# Altium schematic sheet Page08 CPU MISC.SchDoc
size 297 x 209 mm
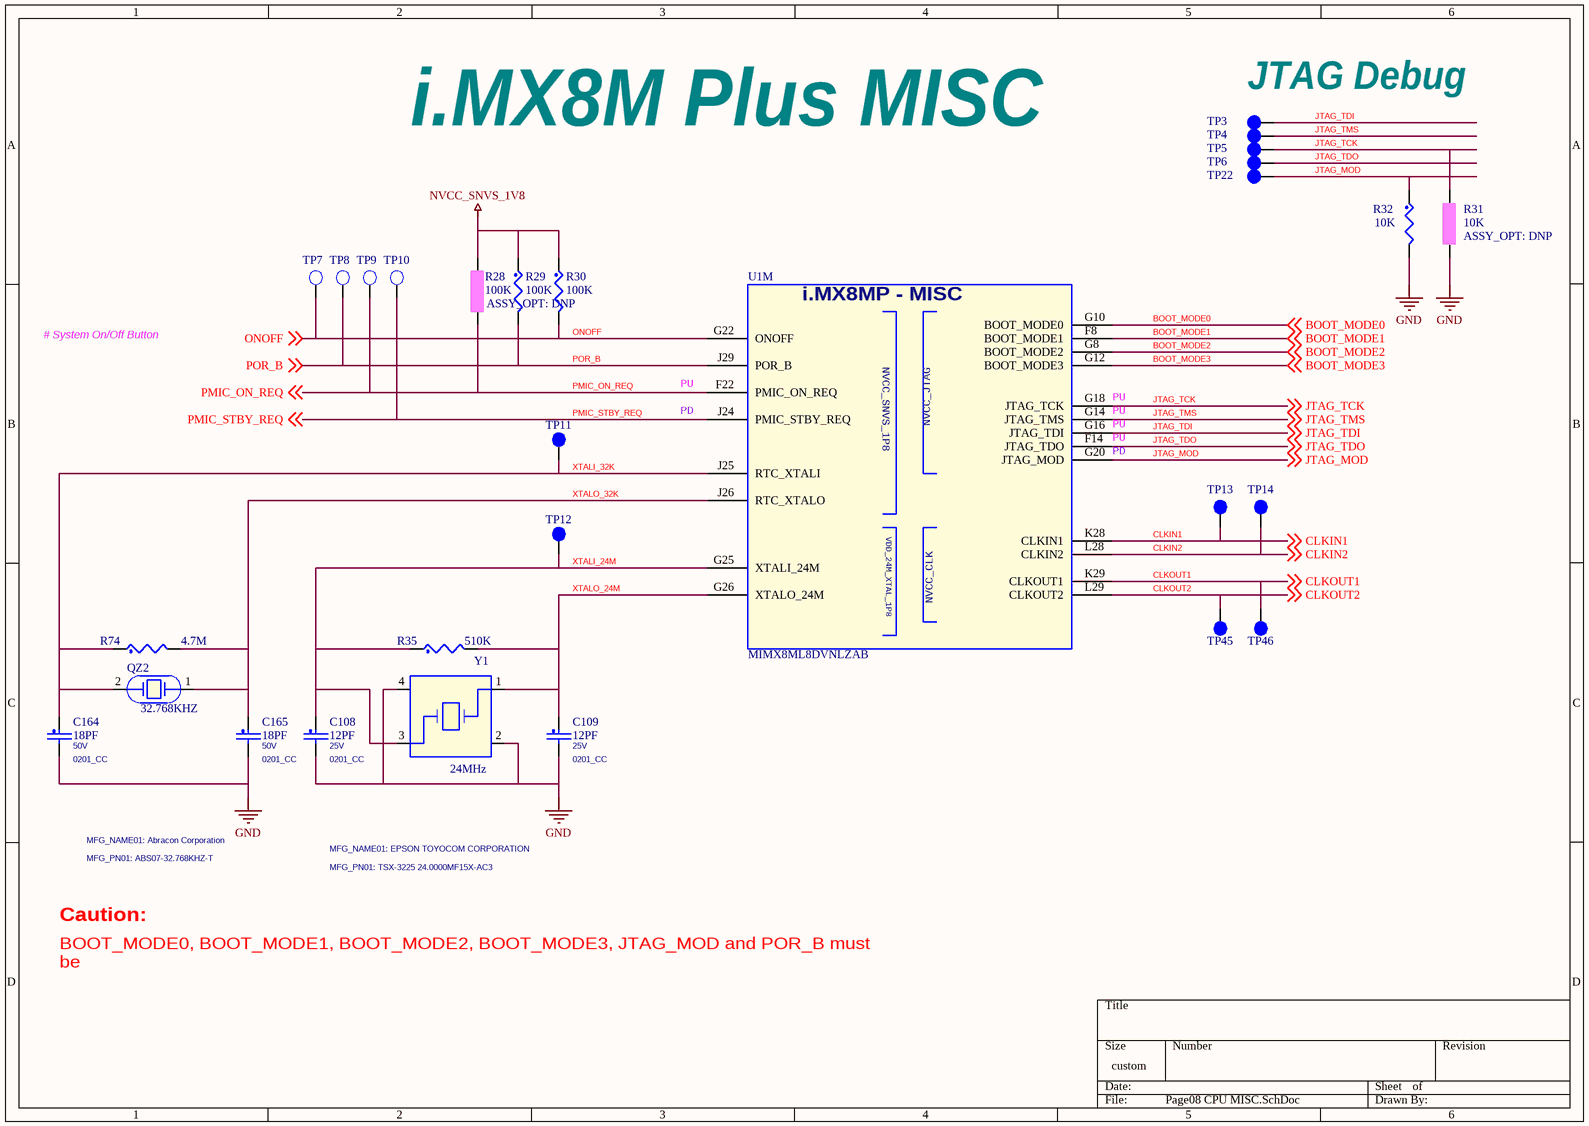
[diagram p0: Page08 CPU MISC.SchDoc]

## Parts
C108  12PF  VOLTAGE: 25V  [0201_CC]
C109  12PF  VOLTAGE: 25V  [0201_CC]
C164  18PF  VOLTAGE: 50V  [0201_CC]
C165  18PF  VOLTAGE: 50V  [0201_CC]
QZ2  32.768KHZ  MFG_PN01: ABS07-32.768KHZ-T  MFG_NAME01: Abracon Corporation  [XTAL2-3P2X1P5-SM]
R28  100K  ASSY_OPT: DNP  [0201_CC]
R29  100K  [0201_CC]
R30  100K  [0201_CC]
R31  10K  ASSY_OPT: DNP  [0201_CC]
R32  10K  [0201_CC]
R35  510K  [0402_CC]
R74  4.7M  [0201_CC]
TP3  tpad_020  [tpad_020]  (value not drawn)
TP4  tpad_020  [tpad_020]  (value not drawn)
TP5  tpad_020  [tpad_020]  (value not drawn)
TP6  tpad_020  [tpad_020]  (value not drawn)
TP7  TP_35MIL  [testpoint_35mil]  (value not drawn)
TP8  TP_35MIL  [testpoint_35mil]  (value not drawn)
TP9  TP_35MIL  [testpoint_35mil]  (value not drawn)
TP10  TP_35MIL  [testpoint_35mil]  (value not drawn)
TP11  TPAD_015  [TPAD_015]  (value not drawn)
TP12  TPAD_015  [TPAD_015]  (value not drawn)
TP13  tpad_020  [tpad_020]  (value not drawn)
TP14  tpad_020  [tpad_020]  (value not drawn)
TP22  tpad_020  [tpad_020]  (value not drawn)
TP45  tpad_020  [tpad_020]  (value not drawn)
TP46  tpad_020  [tpad_020]  (value not drawn)
U1  MIMX8ML8DVNLZAB  [BGA_M865S_0P5_15X15-BMS]  (part M of 15)
Y1  24MHz  MFG_PN01: TSX-3225 24.0000MF15X-AC3  MFG_NAME01: EPSON TOYOCOM CORPORATION  [xtlosc4_3p2x2p5mm_sm]

## Nets
GND: C108.2 C109.2 C164.2 C165.2 R31.2 R32.2 Y1.2 Y1.4
NVCC_SNVS_1V8: R28.1 R29.1 R30.1
BOOT_MODE0: U1.G10(BOOT_MODE0) ; off-sheet BOOT_MODE0
BOOT_MODE1: U1.F8(BOOT_MODE1) ; off-sheet BOOT_MODE1
BOOT_MODE2: U1.G8(BOOT_MODE2) ; off-sheet BOOT_MODE2
BOOT_MODE3: U1.G12(BOOT_MODE3) ; off-sheet BOOT_MODE3
CLKIN1: TP13.1(Pin1) U1.K28(CLKIN1) ; off-sheet CLKIN1
CLKIN2: TP14.1(Pin1) U1.L28(CLKIN2) ; off-sheet CLKIN2
CLKOUT1: TP46.1(Pin1) U1.K29(CLKOUT1) ; off-sheet CLKOUT1
CLKOUT2: TP45.1(Pin1) U1.L29(CLKOUT2) ; off-sheet CLKOUT2
JTAG_MOD: R32.1 TP22.1(Pin1) U1.G20(JTAG_MOD) ; off-sheet JTAG_MOD
JTAG_TCK: R31.1 TP5.1(Pin1) U1.G18(JTAG_TCK) ; off-sheet JTAG_TCK
JTAG_TDI: TP3.1(Pin1) U1.G16(JTAG_TDI) ; off-sheet JTAG_TDI
JTAG_TDO: TP6.1(Pin1) U1.F14(JTAG_TDO) ; off-sheet JTAG_TDO
JTAG_TMS: TP4.1(Pin1) U1.G14(JTAG_TMS) ; off-sheet JTAG_TMS
ONOFF: R30.2 TP7.1(TP) U1.G22(ONOFF) ; off-sheet ONOFF
PMIC_ON_REQ: R28.2 TP9.1(TP) U1.F22(PMIC_ON_REQ) ; off-sheet PMIC_ON_REQ
PMIC_STBY_REQ: TP10.1(TP) U1.J24(PMIC_STBY_REQ) ; off-sheet PMIC_STBY_REQ
POR_B: R29.2 TP8.1(TP) U1.J29(POR_B) ; off-sheet POR_B
XTALI_24M: C108.1 R35.1 TP12.1(Pin1) U1.G25(XTALI_24M) Y1.3
XTALI_32K: C164.1 QZ2.2 R74.1 TP11.1(Pin1) U1.J25(RTC_XTALI)
XTALO_24M: C109.1 R35.2 U1.G26(XTALO_24M) Y1.1
XTALO_32K: C165.1 QZ2.1 R74.2 U1.J26(RTC_XTALO)

## Notes on the sheet
- JTAG Debug
- i.MX8M Plus MISC
- # System On/Off Button
- PU
- (near U1) PU
- (near U1) PD
- BOOT_MODE0, BOOT_MODE1, BOOT_MODE2, BOOT_MODE3, JTAG_MOD and POR_B must be
  pulled to "111111" for i.MX8M Plus to enter Boundary Scan mode.
- Caution:
- (in symbol MIMX8MP_BGA548, part M) i.MX8MP - MISC

## Library data of the parts
C108 = CAP_NP: CAP CER 12PF 25V 5% C0G AEC-Q200 0201; CLASS: DISCRETE; FPLIST: CC0201,CC0201_HD,0201_CC; CAD_APPROVED: Yes; MFG_PN01: CGA1A2C0G1E120J030BA; MFG_NAME01: TDK; AGILE_PN: 150-79813; HEIGHT: 0.33MM; ROHS: Yes; Tolerance: 5%; PCB Footprint: 0201_CC
C109 = CAP_NP: CAP CER 12PF 25V 5% C0G AEC-Q200 0201; CLASS: DISCRETE; AGILE_PN: 150-79813; MFG_NAME01: TDK; MFG_PN01: CGA1A2C0G1E120J030BA; CAD_APPROVED: Yes; FPLIST: CC0201,CC0201_HD,0201_CC; Tolerance: 5%; ROHS: Yes; HEIGHT: 0.33MM; PCB Footprint: 0201_CC
C164 = CAP_NP: CAP CER 18pF 50V 5% C0G 0201; CLASS: DISCRETE; AGILE_PN: 150-79476; MFG_NAME01: MURATA; MFG_PN01: GRM0335C1H180JA01D; CAD_APPROVED: Yes; FPLIST: CC0201,CC0201_HD,0201_CC; Tolerance: 5%; ROHS: Yes; HEIGHT: 0.33MM; PCB Footprint: 0201_CC; Package Size: 0201; Package Type: &#966;180mm Paper taping
C165 = CAP_NP: CAP CER 18pF 50V 5% C0G 0201; CLASS: DISCRETE; FPLIST: CC0201,CC0201_HD,0201_CC; CAD_APPROVED: Yes; MFG_PN01: GRM0335C1H180JA01D; MFG_NAME01: MURATA; AGILE_PN: 150-79476; HEIGHT: 0.33MM; ROHS: Yes; Tolerance: 5%; PCB Footprint: 0201_CC; Package Size: 0201; Package Type: &#966;180mm Paper taping
QZ2 = XTAL: XTAL 32.768KHZ 12.5PF 20PPM 3.2X1.5MM SMT; CLASS: IC; CAD_APPROVED: Yes; AGILE_PN: 230-77653; PCB Footprint: XTAL2-3P2X1P5-SM; HEIGHT: 0.9MM; ROHS: Yes
R28 = RES: RES MF 100K 1/20W 1% 0201; CLASS: DISCRETE; FPLIST: RC0201,0201_CC; CAD_APPROVED: Yes; MFG_PN01: RC-0201-104FT; MFG_NAME01: SKYMOS; AGILE_PN: 470-77704; PCB Footprint: 0201_CC; HEIGHT: 0.26MM; ROHS: Yes; Tolerance: 1%
R29 R30 = RES: RES MF 100K 1/20W 1% 0201; CLASS: DISCRETE; AGILE_PN: 470-77704; MFG_NAME01: SKYMOS; MFG_PN01: RC-0201-104FT; CAD_APPROVED: Yes; FPLIST: RC0201,0201_CC; PCB Footprint: 0201_CC; Tolerance: 1%; ROHS: Yes; HEIGHT: 0.26MM
R31 = RES: RES MF 10K 1/20W 5% 0201; CLASS: DISCRETE; AGILE_PN: 470-79719; MFG_NAME01: RALEC ELECTRONIC CORP; MFG_PN01: RTT01103JTH; CAD_APPROVED: Yes; FPLIST: RC0201,0201_CC; PCB Footprint: 0201_CC; Tolerance: 5%; ROHS: Yes; HEIGHT: 0.26 MM
R32 = RES: RES MF 10K 1/20W 5% 0201; CLASS: DISCRETE; FPLIST: RC0201,0201_CC; CAD_APPROVED: Yes; MFG_PN01: RTT01103JTH; MFG_NAME01: RALEC ELECTRONIC CORP; AGILE_PN: 470-79719; PCB Footprint: 0201_CC; HEIGHT: 0.26 MM; ROHS: Yes; Tolerance: 5%
R35 = RES: RES MF 510K 1/16W 5% 0402; CLASS: DISCRETE; FPLIST: RC0402_25,RC0402_HD,0402_CC; CAD_APPROVED: Yes; MFG_PN01: ERJ-2GEJ514X; MFG_NAME01: PANASONIC; AGILE_PN: 470-76166; PCB Footprint: 0402_CC; HEIGHT: 0.4 MM; ROHS: Yes; Tolerance: 5%
R74 = RES: RES TF 4.7M OHM 1/20W 5% 0201; CLASS: DISCRETE; MFG_PN01: RC0201JR-074M7L; MFG_NAME01: YAGEO AMERICA; Temp Range: -55¡ãC ~ 125C; VOLTAGE: 25V; CAD_APPROVED: Yes; FPLIST: RC0201,0201_CC; AGILE_PN: 470-81235; ROHS: Yes; Tolerance: 5%; HEIGHT: 0.26MM; PCB Footprint: 0201_CC
TP3 TP5 TP45 TP46 = TESTLOOP: TEST POINT PAD 0.5MM DIA SMT, NO PART TO ORDER; ASSY_OPT: DNP; CLASS: IO; CAD_APPROVED: Yes; AGILE_PN: 211-77484; HEIGHT: 0.1MM; ROHS: Yes; PCB Footprint: tpad_020
TP4 TP6 TP13 TP14 TP22 = TESTLOOP: TEST POINT PAD 0.5MM DIA SMT, NO PART TO ORDER; ASSY_OPT: DNP; CLASS: IO; AGILE_PN: 211-77484; CAD_APPROVED: Yes; ROHS: Yes; HEIGHT: 0.1MM; PCB Footprint: tpad_020
TP7 TP9 = T POINT R: TEST POINT PAD .035 SMT, no part to order; CLASS: IC; ASSY_OPT: DNP; AGILE_PN: 510-75618; CAD_APPROVED: Yes; PCB Footprint: testpoint_35mil; ROHS: Yes; HEIGHT: 0.1MM
TP8 TP10 = T POINT R: TEST POINT PAD .035 SMT, no part to order; CLASS: IC; ASSY_OPT: DNP; CAD_APPROVED: Yes; AGILE_PN: 510-75618; PCB Footprint: testpoint_35mil; HEIGHT: 0.1MM; ROHS: Yes
TP11 = TESTLOOP: TEST POINT PAD 15MIL DIA SMT, NO PART TO ORDER; ASSY_OPT: DNP; CLASS: IO; CAD_APPROVED: Yes; MFG_PN01: NOTACOMPONENT; AGILE_PN: 211-76645; PCB Footprint: TPAD_015; HEIGHT: 0.1MM; ROHS: Yes; MFG_NAME01: NOTACOMPONENT
TP12 = TESTLOOP: TEST POINT PAD 15MIL DIA SMT, NO PART TO ORDER; ASSY_OPT: DNP; CLASS: IO; AGILE_PN: 211-76645; MFG_NAME01: NOTACOMPONENT; CAD_APPROVED: Yes; PCB Footprint: TPAD_015; MFG_PN01: NOTACOMPONENT; ROHS: Yes; HEIGHT: 0.1MM
U1 = MIMX8MP_BGA548: IC CPU QUAD CORTEX A53+M4 1.8GHZ BGA548; SPLIT_INST: TRUE; PCB Footprint: bga548_0p5_15x15mm; CAD_APPROVED: Yes; MFG_NAME01: NXP SEMICONDUCTORS; AGILE_PN: 330-77126; CLASS: IC; HEIGHT: 2.1MM; MFG_PN01: MIMX8ML8DVNLZAB
Y1 = XTAL_13Y: XTAL 24MHZ 9pF -- SMT 3.2X2.5MM; CLASS: IC; CAD_APPROVED: Yes; AGILE_PN: 230-77392; PCB Footprint: xtlosc4_3p2x2p5mm_sm; HEIGHT: 0.60MM; ROHS: Yes